# EAGLE design usb-pedal (EAGLE 9.6.2)
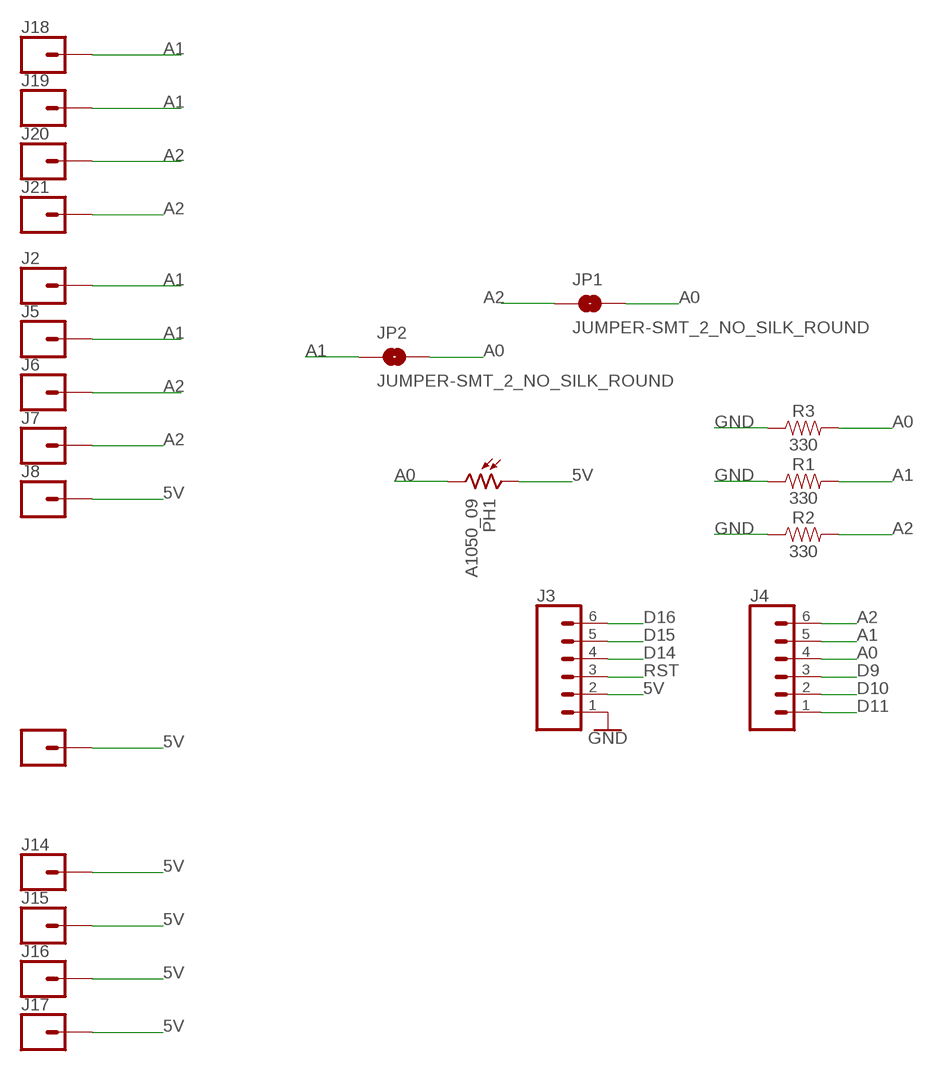
[diagram p0: schematic, sheet 1]

## Parts
J2  CONN_01SMTSO-256-ET-0.165DIA  [SMTSO-256-ET-0.165DIA]
J3  CONN_06LOCK  [1X06_LOCK]
J4  CONN_06LOCK  [1X06_LOCK]
J5  CONN_01SMTSO-256-ET-0.165DIA  [SMTSO-256-ET-0.165DIA]
J6  CONN_01SMTSO-256-ET-0.165DIA  [SMTSO-256-ET-0.165DIA]
J7  CONN_01SMTSO-256-ET-0.165DIA  [SMTSO-256-ET-0.165DIA]
J8  CONN_01SMTSO-256-ET-0.165DIA  [SMTSO-256-ET-0.165DIA]
J12  CONN_01SMTSO-256-ET-0.165DIA  [SMTSO-256-ET-0.165DIA]
J14  CONN_01SMTSO-256-ET-0.165DIA  [SMTSO-256-ET-0.165DIA]
J15  CONN_01SMTSO-256-ET-0.165DIA  [SMTSO-256-ET-0.165DIA]
J16  CONN_01SMTSO-256-ET-0.165DIA  [SMTSO-256-ET-0.165DIA]
J17  CONN_01SMTSO-256-ET-0.165DIA  [SMTSO-256-ET-0.165DIA]
J18  CONN_01SMTSO-256-ET-0.165DIA  [SMTSO-256-ET-0.165DIA]
J19  CONN_01SMTSO-256-ET-0.165DIA  [SMTSO-256-ET-0.165DIA]
J20  CONN_01SMTSO-256-ET-0.165DIA  [SMTSO-256-ET-0.165DIA]
J21  CONN_01SMTSO-256-ET-0.165DIA  [SMTSO-256-ET-0.165DIA]
JP1  JUMPER-SMT_2_NO_SILK_ROUND  [SMT-JUMPER_2_NO_SILK_ROUND]
JP2  JUMPER-SMT_2_NO_SILK_ROUND  [SMT-JUMPER_2_NO_SILK_ROUND]
PH1  A1050_09  [T0-46-A10XX]
R1  330  330OHM-HORIZ-1/10W-5%  [AXIAL-0.3]
R2  330  330OHM-HORIZ-1/10W-5%  [AXIAL-0.3]
R3  330  330OHM-HORIZ-1/10W-5%  [AXIAL-0.3]

## Nets
5V: J3.2 J8.P$1 J12.P$1 J14.P$1 J15.P$1 J16.P$1 J17.P$1 PH1.1
A0: J4.4 JP1.2 JP2.2 PH1.2 R3.P$2
A1: J2.P$1 J4.5 J5.P$1 J18.P$1 J19.P$1 JP2.1 R1.P$2
A2: J4.6 J6.P$1 J7.P$1 J20.P$1 J21.P$1 JP1.1 R2.P$2
D9: J4.3
D10: J4.2
D11: J4.1
D14: J3.4
D15: J3.5
D16: J3.6
GND: J3.1 R1.P$1 R2.P$1 R3.P$1
RST: J3.3

## Library data of the parts
J2 J5-J8 J12 J14-J21 = SparkFun-Connectors:CONN_01: Single connection point. Often used as Generic Header-pin footprint for 0.1 inch spaced/style header connections On any of the 0.1 inch spaced packages, you can populate with these: Break Away Headers - Straight <https://www.sparkfun.com/products/116> (PRT-00116) Break Away Male Headers - Right Angle <https://www.sparkfun.com/products/553> (PRT-00553) Female Headers <https://www.sparkfun.com/products/115> (PRT-00115) Break Away Headers - Machine Pin <https://www.sparkfun.com/products/117> (PRT-00117) Break Away Female Headers - Swiss Machine Pin <https://www.sparkfun.com/products/743> (PRT-00743) This device is also useful as a general connection point to wire up your design to another part of your project. Our various solder wires solder well into these plated through hole pads. Hook-Up Wire - Assortment (Stranded, 22 AWG) <https://www.sparkfun.com/products/11375> (PRT-11375) Hook-Up Wire - Assortment (Solid Core, 22 AWG) <https://www.sparkfun.com/products/11367> (PRT-11367) View the entire wire category on our website here <https://www.sparkfun.com/categories/141> Special notes: SMTSO-256-ET is a "flush mount" nut for a 4-40 screw. We mostly use this on specialty testbeds; it is a nice way to connect hardware to your PCB at an adjustable hieght. Also note, the SNAP packages are for using a snappable style connector. We sell a baggie of snaps and they are also used on two LilyPad designs: Snap Assortment - 30 pack (male and female) <https://www.sparkfun.com/products/11347> (DEV-11347) LilyPad Arduino SimpleSnap <https://www.sparkfun.com/products/10941> (DEV-10941) LilyPad SimpleSnap Protoboard <https://www.sparkfun.com/products/10940> (DEV-10940); PROD_ID: HW-08694
J3 J4 = SparkFun-Connectors:CONN_06: Multi connection point. Often used as Generic Header-pin footprint for 0.1 inch spaced/style header connections On any of the 0.1 inch spaced packages, you can populate with these: Break Away Headers - Straight <https://www.sparkfun.com/products/116> (PRT-00116) Break Away Male Headers - Right Angle <https://www.sparkfun.com/products/553> (PRT-00553) Female Headers <https://www.sparkfun.com/products/115> (PRT-00115) Break Away Headers - Machine Pin <https://www.sparkfun.com/products/117> (PRT-00117) Break Away Female Headers - Swiss Machine Pin <https://www.sparkfun.com/products/743> (PRT-00743) Arduino Stackable Header - 6 Pin <https://www.sparkfun.com/products/9280> (PRT-09280) For SCREWTERMINALS and SPRING TERMINALS visit here: Screw Terimnals on SparkFun.com <https://www.sparkfun.com/search/results?term=Screw+Terminals> (5mm/3.5mm/2.54mm spacing) This device is also useful as a general connection point to wire up your design to another part of your project. Our various solder wires solder well into these plated through hole pads. Hook-Up Wire - Assortment (Stranded, 22 AWG) <https://www.sparkfun.com/products/11375> (PRT-11375) Hook-Up Wire - Assortment (Solid Core, 22 AWG) <https://www.sparkfun.com/products/11367> (PRT-11367) View the entire wire category on our website here <https://www.sparkfun.com/categories/141>
JP1 JP2 = SparkFun-Jumpers:JUMPER-SMT_2_NO: Normally open jumper This jumper has two pads in close proximity to each other. Apply solder to close the connection. Round pads are easier to solder for beginners, but are a lot larger. SparkFun Product that uses the round pads: SparkFun EL Sequencer <https://www.sparkfun.com/products/12781>
PH1 = photo-elements:A10: Sensor Robust Light Sensing Applications Outdoor Light Sensing Application Source: http://optoelectronics.perkinelmer.com/content/Datasheets/DTS_PhotocellsA1050.pdf
R1-R3 = SparkFun-Resistors:330OHM: 330Ω resistor A resistor is a passive two-terminal electrical component that implements electrical resistance as a circuit element. Resistors act to reduce current flow, and, at the same time, act to lower voltage levels within circuits. - Wikipedia; PROD_ID: RES-8371

## Board
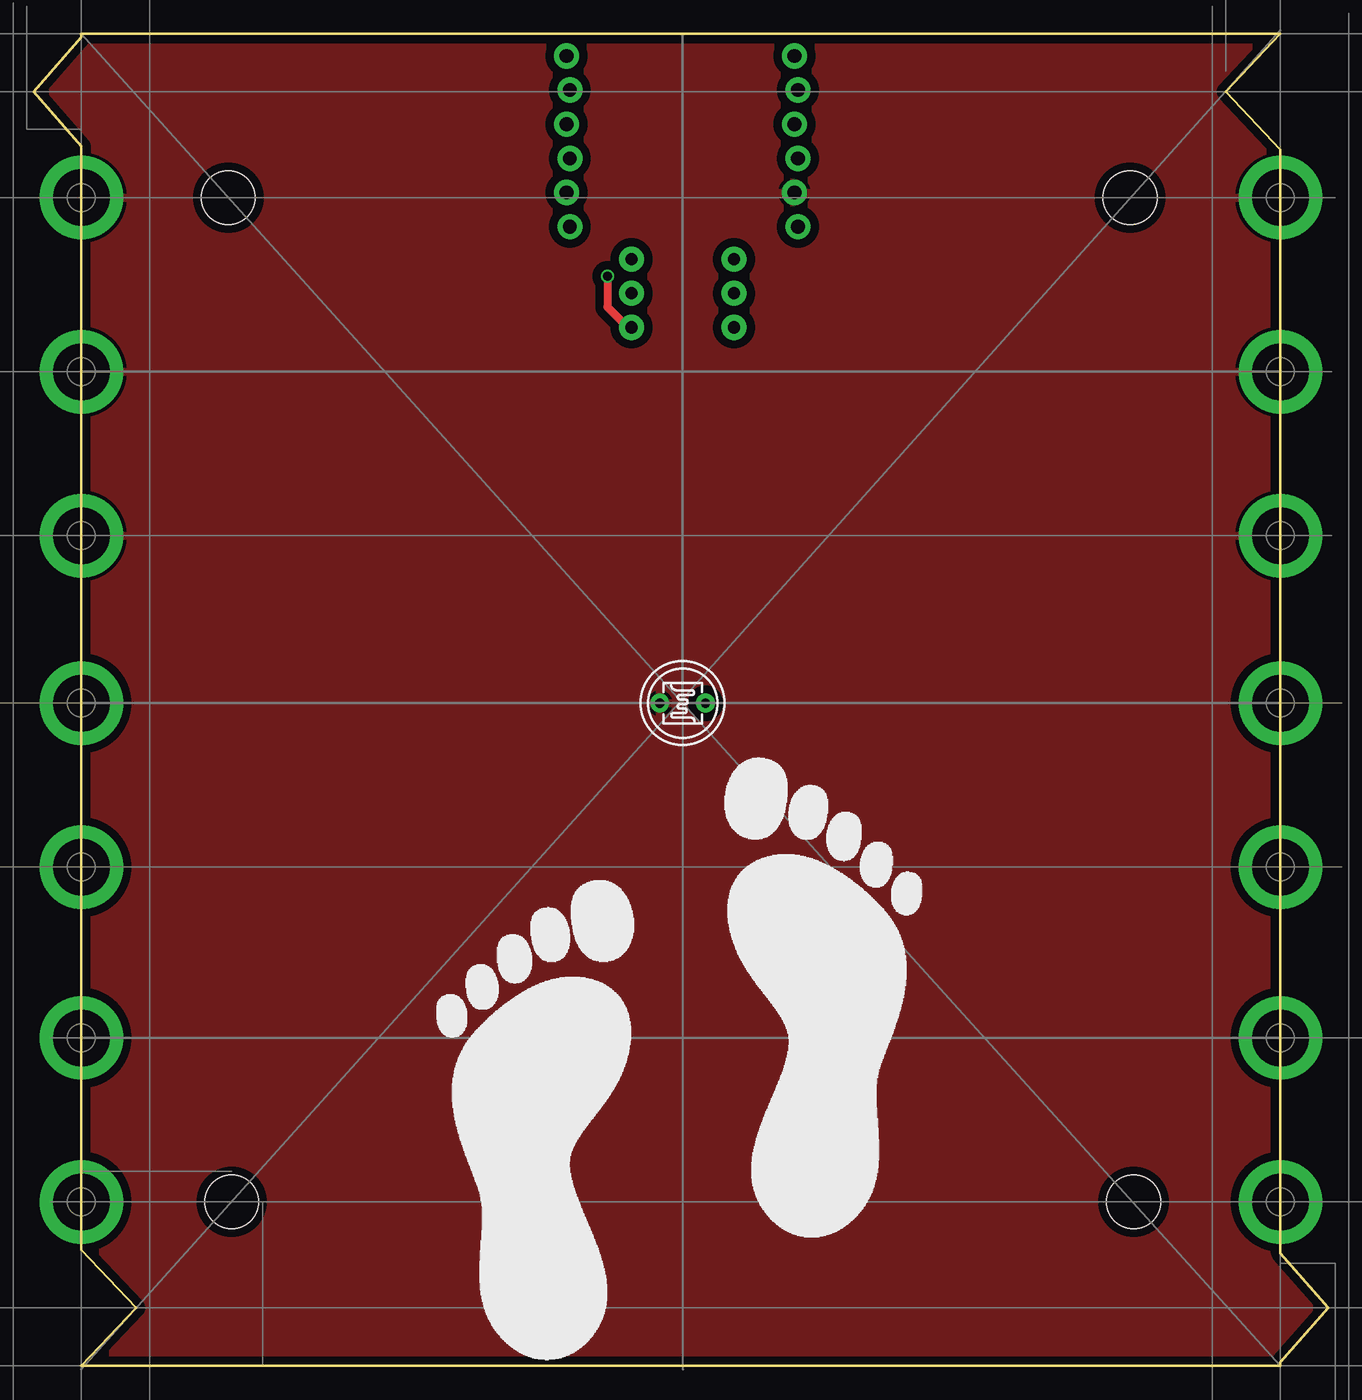
[diagram p1: board, top side]
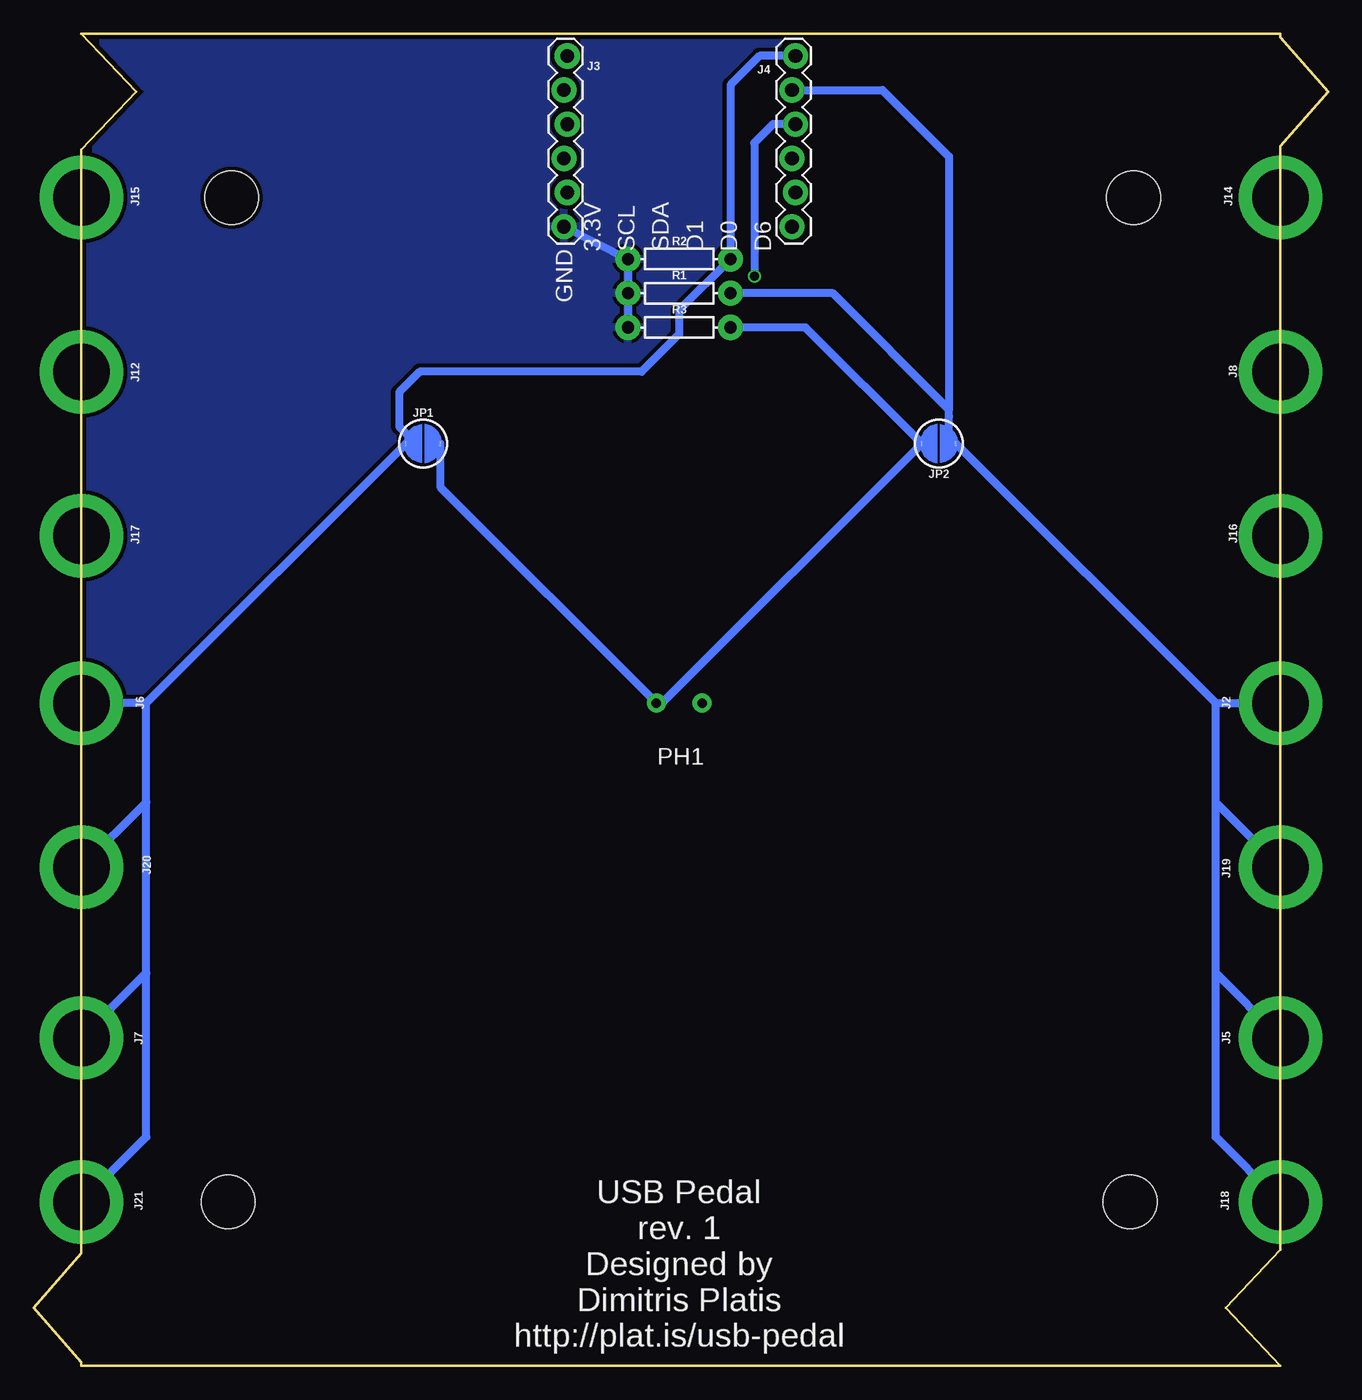
[diagram p2: board, bottom side, seen from below]

Size 96.27 x 99.06 mm. Coordinates in mm from the lower left corner, seen from the top.
Outline: 3.56,99.06 92.71,99.06 88.65,94.74 92.71,90.42 92.71,8.38 96.27,4.32 92.71,0.25 92.71,0 3.56,0 7.62,4.32 3.56,8.64 3.56,90.68 0,94.74 3.56,98.81 3.56,99.06
Copper layers (1*16): Top 0.035mm / dielectric 1.5mm / Bottom 0.035mm
Design rules "SeeedStudio_2layer_DRU_edited": minimum track width 7mil, minimum drill 15mil, track to track 6mil, track to pad 6mil, pad to pad 6mil, via to via 6mil, smd to smd 0mil, copper to edge 10mil, drill to drill 10mil, minimum pad ring 10mil, minimum via ring 6mil, stop-mask expansion 2mil, vias tented up to drill 100mil, thermal gap 10mil
Holes 4 mm at 14.73,12.19 81.53,86.87 14.48,86.87 81.79,12.19

### Footprints (pad centres in the part's own frame; a part is rotated, then mirrored left to right if it is on the bottom)
SMTSO-256-ET-0.165DIA = drill 4.191 pad 6.198: P$1 0,0
1X06_LOCK = drill 1.016 pad 1.88: 1 0,0; 2 2.54,-0.254; 3 5.08,0; 4 7.62,-0.254; 5 10.16,0; 6 12.7,-0.254
SMT-JUMPER_2_NO_SILK_ROUND = smd 0.152 x 0.305: 1 -1.27,0; 2 1.27,0
T0-46-A10XX = drill 0.7 pad 1.4: 1 -1.7,0; 2 1.7,0
AXIAL-0.3 = drill 0.9 pad 1.88: P$1 -3.81,0; P$2 3.81,0

### Placement (x,y rotation side)
J2  3.56,49.28 270 top
J3  56.83,84.71 90 bottom
J4  39.88,84.71 90 bottom
J5  3.56,24.38 270 top
J6  92.71,49.28 90 top
J7  92.71,24.38 90 top
J8  3.56,73.91 270 top
J12  92.71,73.91 90 top
J14  3.56,86.87 0 top
J15  92.71,86.87 0 top
J16  3.56,61.72 0 top
J17  92.71,61.72 0 top
J18  3.56,12.19 0 top
J19  3.56,37.08 0 top
J20  92.71,37.08 0 top
J21  92.71,12.19 0 top
JP1  67.31,68.58 0 bottom
JP2  28.96,68.58 180 bottom
PH1  48.26,49.28 0 top
R1  48.26,79.76 0 bottom
R2  48.26,82.3 0 bottom
R3  48.26,77.22 0 bottom

### Tracks (layer width: path | path; a pad name or v marks a point on that pad's centre or on a via)
5V
  pour Top (isolate 0.61): 3.56,99.06 93.03,99.06 87.63,94.74 92.71,90.17 92.71,8.64 97.79,4.06 92.71,0 3.56,0 8.64,4.32 3.56,8.64 3.56,90.42 -1.52,94.74
A0  (via drill 0.65)
  Top 0.61: v42.67,81.03 42.67,78.74 44.2,77.22 R3.P$2
  Bottom 0.61: R3.P$2 38.86,77.22 JP2.2 49.53,49.28 PH1.2 66.04,65.36 JP1.2 66.55,68.58 66.8,68.83 | J4.4 41.28,92.33 42.67,90.93 v42.67,81.03
A1
  Bottom 0.61: 28.19,68.58 JP2.1 8.38,49.28 | 28.19,68.58 28.45,68.58 | 28.19,68.58 28.19,70.61 28.19,71.12 | 8.38,49.28 J2.P$1 | J19.P$1 8.38,41.91 | 8.38,41.91 8.38,49.28 | J5.P$1 8.38,29.21 | 8.38,29.21 8.38,41.91 | J18.P$1 8.38,17.02 8.38,29.21 | R1.P$2 36.83,79.76 28.19,71.12 | J4.5 33.15,94.87 28.19,89.92 28.19,71.12
A2
  Bottom 0.61: 68.2,68.96 JP1.1 87.88,49.28 | 87.88,49.28 J6.P$1 | J20.P$1 87.88,41.91 | 87.88,41.91 87.88,49.28 | J7.P$1 87.88,29.21 | 87.88,29.21 87.88,41.91 | J21.P$1 87.88,17.02 87.88,29.21 | J4.6 42.29,97.41 44.45,95.25 R2.P$2 48.26,78.49 48.26,76.71 51.05,73.91 67.56,73.91 69.09,72.39 69.09,69.85 68.2,68.96 | 68.2,68.96 68.07,69.09
GND
  Bottom 0.61: J3.1 R2.P$1 R1.P$1 R3.P$1
  pour Bottom (isolate 0.305): 3.56,99.06 -1.52,94.74 3.56,90.42 3.56,8.64 8.64,4.32 3.56,0 92.71,0 97.79,4.32 92.71,8.64 92.71,90.17 87.63,94.74 92.71,99.06

### Text on the board
bPlace: 3.3V / SCL / SDA / D1 / D0 / D6 | GND
bNames: USB Pedal / rev. 1 / Designed by / Dimitris Platis / http://plat.is/usb-pedal